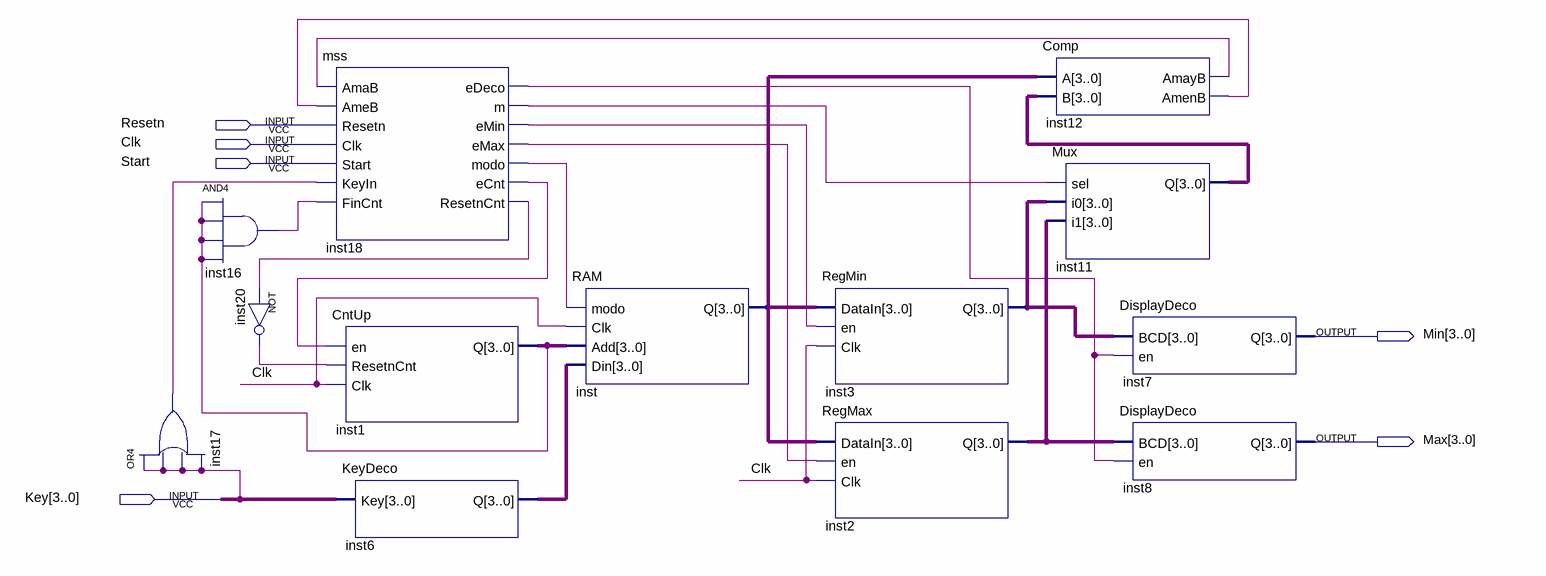
[diagram p0: schematic sheet]
// Quartus schematic RamMaxMin.bdf as structural Verilog: 13 symbols, 6 pins
module RamMaxMin (
  input  Resetn,
  input  Clk,
  input  Start,
  input  [3:0] Key,
  output [3:0] Min,
  output [3:0] Max
);

  wire inst12_amayb, inst12_amenb, inst16_out, inst17_out, inst18_ecnt, inst18_edeco, inst18_emax,
       inst18_emin, inst18_m, inst18_modo, inst18_resetncnt, inst20_out, undriven, undriven_2;
  wire [3:0] inst1_q, inst2_q, inst3_q, inst6_q, inst11_q, inst_q;

  or inst17 (inst17_out, undriven_2, undriven_2, undriven_2, undriven_2);
  and inst16 (inst16_out, undriven, undriven, undriven, undriven);
  not inst20 (inst20_out, inst18_resetncnt);
  mss inst18 (
    .AmaB(inst12_amayb), .AmeB(inst12_amenb), .Resetn(Resetn), .Clk(Clk), .Start(Start), .KeyIn(inst17_out),
    .FinCnt(inst16_out), .eDeco(inst18_edeco), .m(inst18_m), .eMin(inst18_emin), .eMax(inst18_emax),
    .modo(inst18_modo), .eCnt(inst18_ecnt), .ResetnCnt(inst18_resetncnt));
  CntUp inst1 (.en(inst18_ecnt), .ResetnCnt(inst20_out), .Clk(Clk), .Q(inst1_q));
  KeyDeco inst6 (.Key(Key), .Q(inst6_q));
  RAM inst (.modo(inst18_modo), .Clk(Clk), .Add(inst1_q), .Din(inst6_q), .Q(inst_q));
  RegMin inst3 (.DataIn(inst_q), .en(inst18_emin), .Clk(Clk), .Q(inst3_q));
  RegMax inst2 (.DataIn(inst_q), .en(inst18_emax), .Clk(Clk), .Q(inst2_q));
  Comp inst12 (.A(inst_q), .B(inst11_q), .AmayB(inst12_amayb), .AmenB(inst12_amenb));
  Mux inst11 (.sel(inst18_m), .i0(inst3_q), .i1(inst2_q), .Q(inst11_q));
  DisplayDeco inst7 (.BCD(inst3_q), .en(inst18_edeco), .Q(Min));
  DisplayDeco inst8 (.BCD(inst2_q), .en(inst18_edeco), .Q(Max));
endmodule
